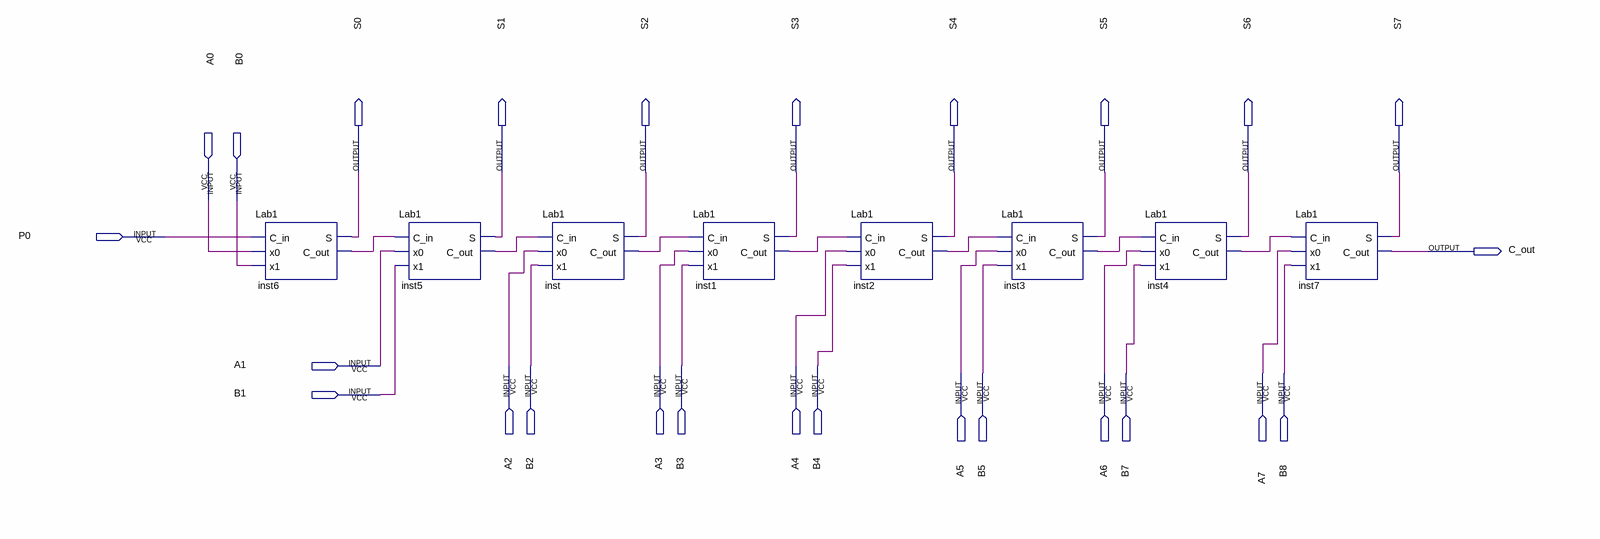
[diagram p0: schematic sheet]
// Quartus schematic Block2.bdf as structural Verilog: 8 symbols, 26 pins
module Block2 (
  input  A0,
  input  B0,
  input  P0,
  input  A1,
  input  A2,
  input  B2,
  input  A3,
  input  B3,
  input  A4,
  input  B4,
  input  A5,
  input  B5,
  input  A6,
  input  B7,
  input  A7,
  input  B8,
  input  B1,
  output S0,
  output S1,
  output S2,
  output S3,
  output S4,
  output S5,
  output S6,
  output S7,
  output C_out
);

  wire inst1_c_out, inst2_c_out, inst3_c_out, inst4_c_out, inst5_c_out, inst6_c_out, inst_c_out;

  Lab1 inst6 (.C_in(P0), .x0(A0), .x1(B0), .S(S0), .C_out(inst6_c_out));
  Lab1 inst5 (.C_in(inst6_c_out), .x0(A1), .x1(B1), .S(S1), .C_out(inst5_c_out));
  Lab1 inst (.C_in(inst5_c_out), .x0(A2), .x1(B2), .S(S2), .C_out(inst_c_out));
  Lab1 inst1 (.C_in(inst_c_out), .x0(A3), .x1(B3), .S(S3), .C_out(inst1_c_out));
  Lab1 inst2 (.C_in(inst1_c_out), .x0(A4), .x1(B4), .S(S4), .C_out(inst2_c_out));
  Lab1 inst3 (.C_in(inst2_c_out), .x0(A5), .x1(B5), .S(S5), .C_out(inst3_c_out));
  Lab1 inst4 (.C_in(inst3_c_out), .x0(A6), .x1(B7), .S(S6), .C_out(inst4_c_out));
  Lab1 inst7 (.C_in(inst4_c_out), .x0(A7), .x1(B8), .S(S7), .C_out(C_out));
endmodule
